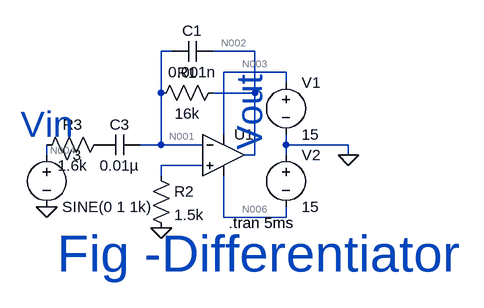
[diagram p0: schematic Prac-10 Differentiator.asc]
Prac-10 Differentiator.asc, the LTspice schematic file:
Version 4
SHEET 1 880 680
WIRE 128 64 112 64
WIRE 256 64 192 64
WIRE 304 96 208 96
WIRE 304 112 304 96
WIRE 112 128 112 64
WIRE 256 128 256 64
WIRE 256 128 192 128
WIRE 208 192 208 96
WIRE 112 208 112 128
WIRE 112 208 80 208
WIRE 176 208 112 208
WIRE 304 208 304 192
WIRE 400 208 304 208
WIRE -64 224 -64 208
WIRE 256 224 256 128
WIRE 256 224 240 224
WIRE 304 224 304 208
WIRE 400 224 400 208
WIRE 176 240 112 240
WIRE 112 256 112 240
WIRE 208 320 208 256
WIRE 304 320 304 304
WIRE 304 320 208 320
FLAG 400 224 0
FLAG 112 336 0
FLAG -64 304 0
SYMBOL voltage 304 96 R0
SYMATTR InstName V1
SYMATTR Value 15
SYMBOL voltage 304 208 R0
SYMATTR InstName V2
SYMATTR Value 15
SYMBOL voltage -64 208 R0
WINDOW 123 0 0 Left 0
WINDOW 39 0 0 Left 0
SYMATTR InstName V3
SYMATTR Value SINE(0 1 1k)
SYMBOL res 208 112 R90
WINDOW 0 0 56 VBottom 2
WINDOW 3 32 56 VTop 2
SYMATTR InstName R1
SYMATTR Value 16k
SYMBOL res 96 240 R0
SYMATTR InstName R2
SYMATTR Value 1.5k
SYMBOL res 32 192 R90
WINDOW 0 0 56 VBottom 2
WINDOW 3 32 56 VTop 2
SYMATTR InstName R3
SYMATTR Value 1.6k
SYMBOL cap 192 48 R90
WINDOW 0 0 32 VBottom 2
WINDOW 3 32 32 VTop 2
SYMATTR InstName C1
SYMATTR Value 0.001n
SYMBOL OpAmps\\UniversalOpAmp 208 224 R0
SYMATTR InstName U1
SYMBOL cap 80 192 R90
WINDOW 0 0 32 VBottom 2
WINDOW 3 32 32 VTop 2
SYMATTR InstName C3
SYMATTR Value 0.01µ
TEXT -48 376 Left 6 ;Fig -Differentiator
TEXT 216 328 Left 2 !.tran 5ms
TEXT -104 176 Left 5 ;Vin
TEXT 248 216 VLeft 5 ;Vout

The netlist it stands for:
* Prac-10 Differentiator.asc
V1 N003 0 15
V2 0 N006 15
V3 N004 0 SINE(0 1 1k)
R1 N002 N001 16k
R2 N005 0 1.5k
R3 P001 N004 1.6k
C1 N002 N001 0.001n
XU1 N005 N001 N003 N006 N002 level1 Avol=1Meg GBW=10Meg Vos=0 En=0 Enk=0 In=0 Ink=0 Rin=500Meg  ; pins In+ In- V+ V- OUT
C3 N001 P001 0.01µ
* Fig -Differentiator
.tran 5ms
* Vin
* Vout
.lib UniversalOpAmp1.lib
.backanno
.end

* Results of the author's LTspice run, read from the files saved beside the schematic
* Operating Point, zero values left out:
*   V(n003) = 15 V
*   V(n006) = -15 V
*   I(V1) = -30 nA
*   I(V2) = -30 nA
*   Ix(u1:3) = 30 nA
*   Ix(u1:4) = -30 nA
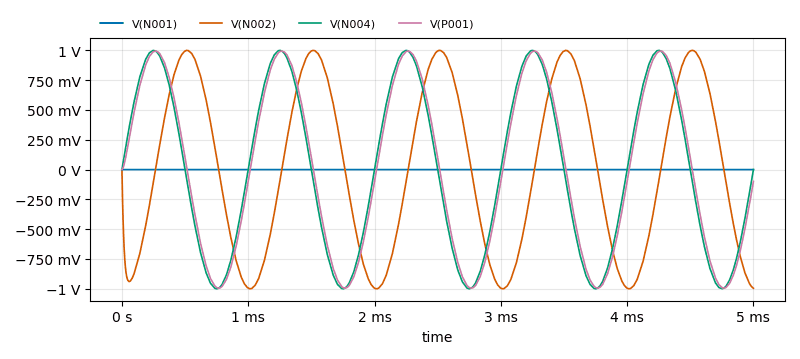
[diagram p1: Transient Analysis of Prac-10 Differentiator.asc, plotted from the saved traces]
* Transient Analysis, 1 run:
*   V(N001): min -100 µV, max 951.7 µV, average 3.231 µV, rms 81.37 µV, last 10.92 µV
*   V(N002): min -1 V, max 1 V, average 3.173 mV, rms 704 mV, last -995.4 mV
*   V(N004): min -1 V, max 1 V, average -79.48 µV, rms 706.9 mV, last 0 V
*   V(P001): min -994.7 mV, max 994.7 mV, average 237.2 µV, rms 703.3 mV, last -99.54 mV